# Altium schematic sheet Sheet1.SCHDOC
size 420 x 297 mm; SheetNumber: 1; SheetTotal: 1; DocumentName: Sheet1.SCHDOC
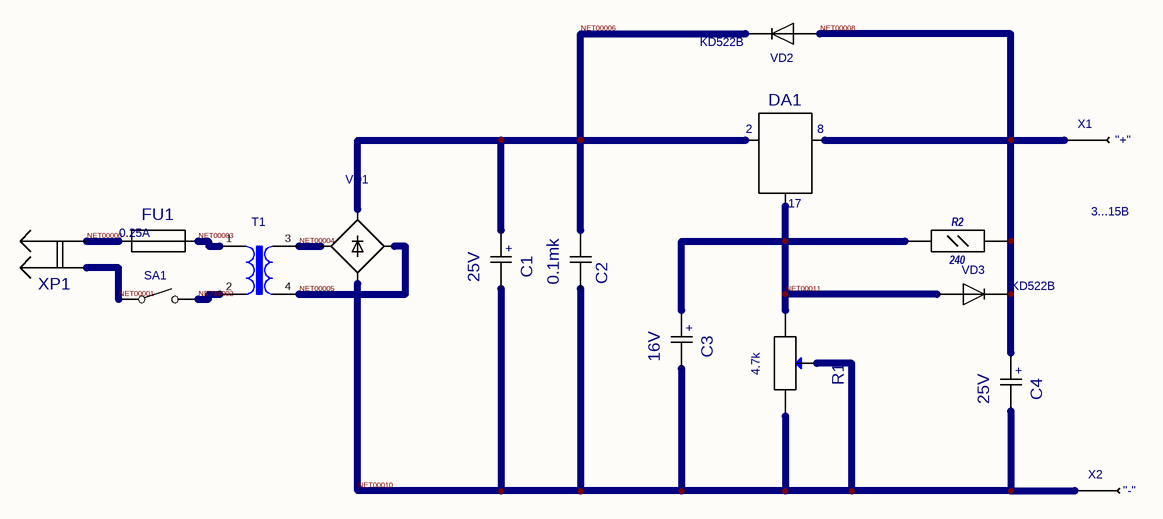
[diagram p0: Sheet1.SCHDOC]

## Parts
C1  value 25V  [CAP2]  (hidden comment: CAP2)
C2  value 0.1mk  [CAP1]  (hidden comment: CAP1)
C3  value 16V  [CAP2]  (hidden comment: CAP2)
C4  value 25V  [CAP2]  (hidden comment: CAP2)
DA1  КР1158ЕН5  [KT26-3]  (value not drawn)
FU1  value 0.25A  [VP1-1]  (hidden comment: ВП1-1)
R1  value 4.7k  [RESVAR]  (hidden comment: RESVAR)
R2  value 240  [МЛТ(0.125)]  (hidden comment: МЛТ(0.125))
SA1  TURN  [TRN]  (value not drawn)
T1  TR  [TR]  (value not drawn)
VD1  DIODEBRIDGE  [DIODEBRIDGE]  (value not drawn)
VD2  value KD522B  [DIODE]  (hidden comment: DIODE)
VD3  value KD522B  [DIODE]  (hidden comment: DIODE)
X1  CONN1X  [CONN1X]  (value not drawn)
X2  CONN1X  [CONN1X]  (value not drawn)
XP1  2XR  [2XR]  (value not drawn)

## Nets
NET00000: FU1.1(I/O1) XP1.2(I/O2)
NET00001: SA1.1 XP1.1(I/O1)
NET00002: SA1.2 T1.2
NET00003: FU1.2(I/O2) T1.1
NET00004: T1.3 VD1.1
NET00005: T1.4 VD1.2
NET00006: C1.1 C2.1 DA1.1(IN0) VD1.4 VD2.2
NET00008: C4.1 DA1.3(OUT0) R2.2 VD2.1 VD3.2 X1.1
NET00010: C1.2 C2.2 C3.2 C4.2 R1.2 R1.3 VD1.3 X2.1
NET00011: C3.1 DA1.2(GND0) R1.1 R2.1 VD3.1

Not connected (* = marked no-connect by the designer): FU1 3 4

## Notes on the sheet
- (near DA1) 2
- (near DA1) 8
- (near X1) "+"
- (near DA1) 17
- 3...15B
- (near X2) "-"
- (in symbol CAP2) +

## Library data of the parts
DA1 = КР1158ЕН5: Value: LM317T
VD1 = DIODEBRIDGE: Value: KC407A
X1 X2 = CONN1X: Value: X1
SA1 = TURN: Value: *
T1 = TR: Value: *
XP1 = 2XR: Value: *